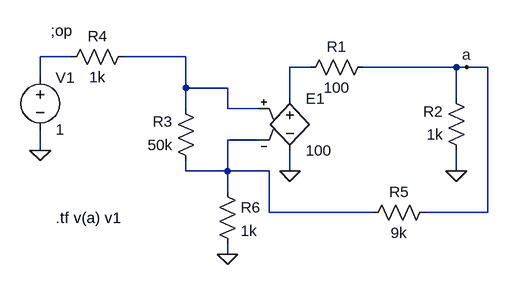
[diagram p0: schematic prueba real1.asc]
prueba real1.asc, the LTspice schematic file:
Version 4
SHEET 1 880 680
WIRE -96 96 -144 96
WIRE 80 96 -16 96
WIRE 272 112 240 112
WIRE 496 112 352 112
WIRE 512 112 496 112
WIRE 544 112 512 112
WIRE -144 128 -144 96
WIRE 80 144 80 96
WIRE 144 144 80 144
WIRE 240 160 240 112
WIRE 496 160 496 112
WIRE 80 176 80 144
WIRE 144 176 144 144
WIRE 192 176 144 176
WIRE 192 224 144 224
WIRE -144 240 -144 208
WIRE 80 272 80 256
WIRE 144 272 144 224
WIRE 144 272 80 272
WIRE 208 272 144 272
WIRE 240 272 240 240
WIRE 496 272 496 240
WIRE 144 304 144 272
WIRE 208 336 208 272
WIRE 368 336 208 336
WIRE 544 336 544 112
WIRE 544 336 448 336
WIRE 144 400 144 384
FLAG 240 272 0
FLAG 496 272 0
FLAG 144 400 0
FLAG -144 240 0
FLAG 512 112 a
SYMBOL e 240 144 R0
SYMATTR InstName E1
SYMATTR Value 100
SYMBOL res 368 96 R90
WINDOW 0 0 56 VBottom 2
WINDOW 3 32 56 VTop 2
SYMATTR InstName R1
SYMATTR Value 100
SYMBOL res 512 256 R180
WINDOW 0 36 76 Left 2
WINDOW 3 36 40 Left 2
SYMATTR InstName R2
SYMATTR Value 1k
SYMBOL res 96 272 R180
WINDOW 0 36 76 Left 2
WINDOW 3 36 40 Left 2
SYMATTR InstName R3
SYMATTR Value 50k
SYMBOL res -112 112 R270
WINDOW 0 32 56 VTop 2
WINDOW 3 0 56 VBottom 2
SYMATTR InstName R4
SYMATTR Value 1k
SYMBOL res 352 352 R270
WINDOW 0 32 56 VTop 2
WINDOW 3 0 56 VBottom 2
SYMATTR InstName R5
SYMATTR Value 9k
SYMBOL res 128 288 R0
SYMATTR InstName R6
SYMATTR Value 1k
SYMBOL voltage -144 112 R0
WINDOW 123 0 0 Left 2
WINDOW 39 0 0 Left 2
SYMATTR InstName V1
SYMATTR Value 1
TEXT -128 56 Left 2 !;op
TEXT -120 344 Left 2 !.tf v(a) v1

The netlist it stands for:
* prueba real1.asc
E1 N003 0 N002 N004 100
R1 a N003 100
R2 0 a 1k
R3 N004 N002 50k
R4 N001 N002 1k
R5 N004 a 9k
R6 N004 0 1k
V1 N001 0 1
;op
.tf v(a) v1
.backanno
.end